# EasyEDA Pro project original-v2.epro, board PCB2
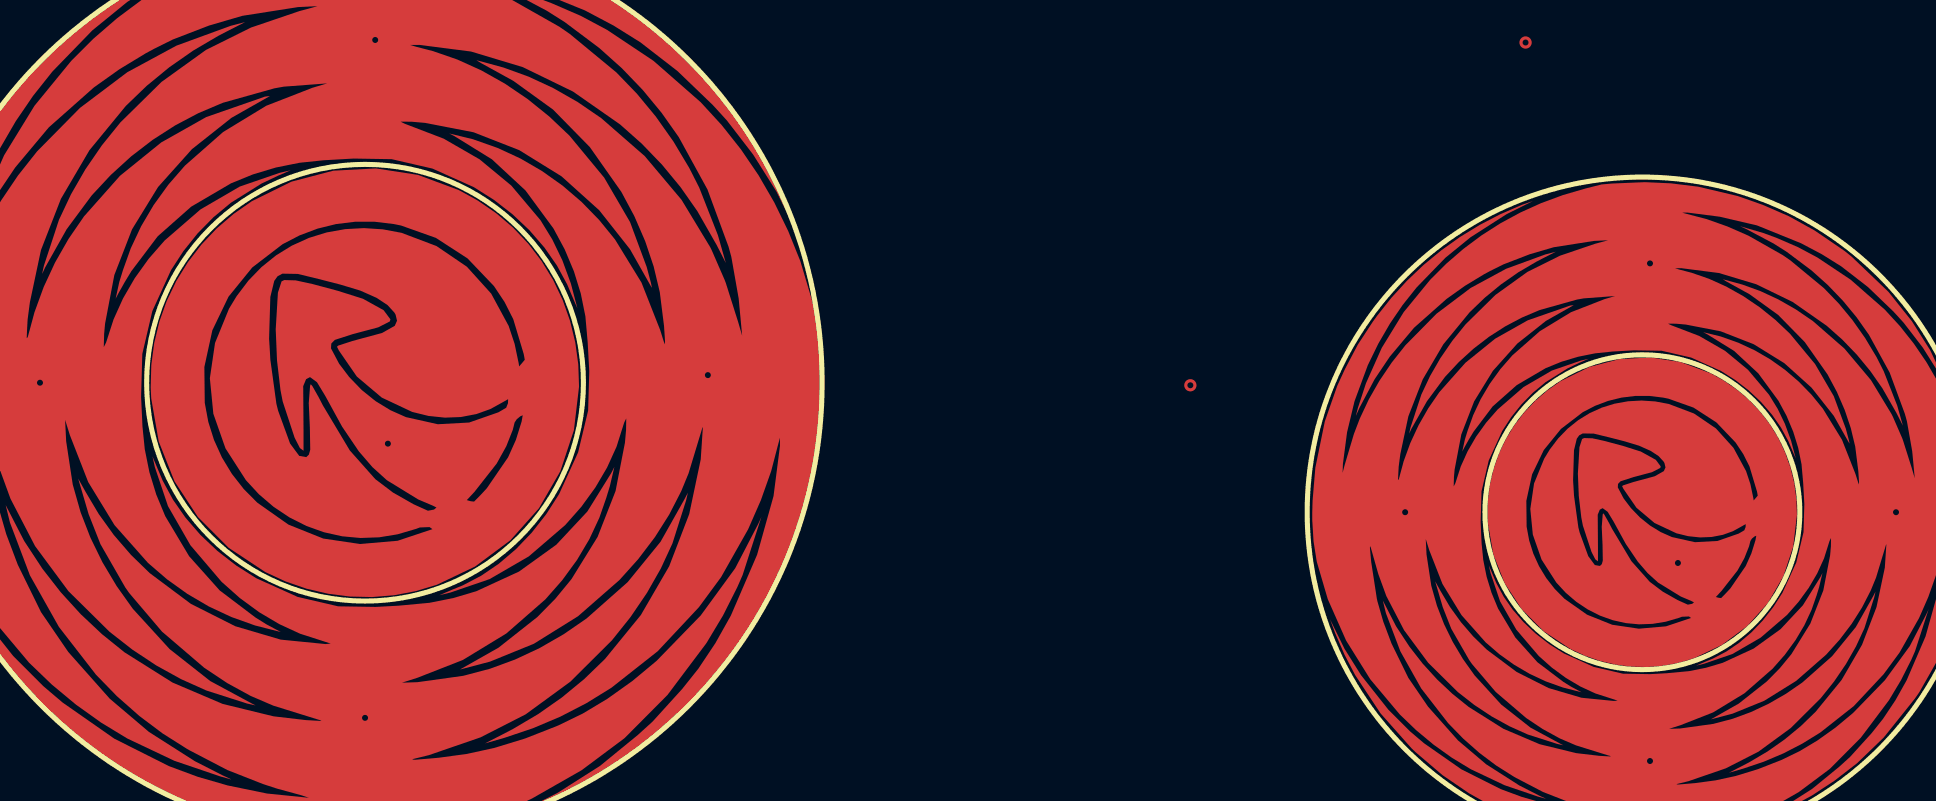
[diagram p11: board, top side]
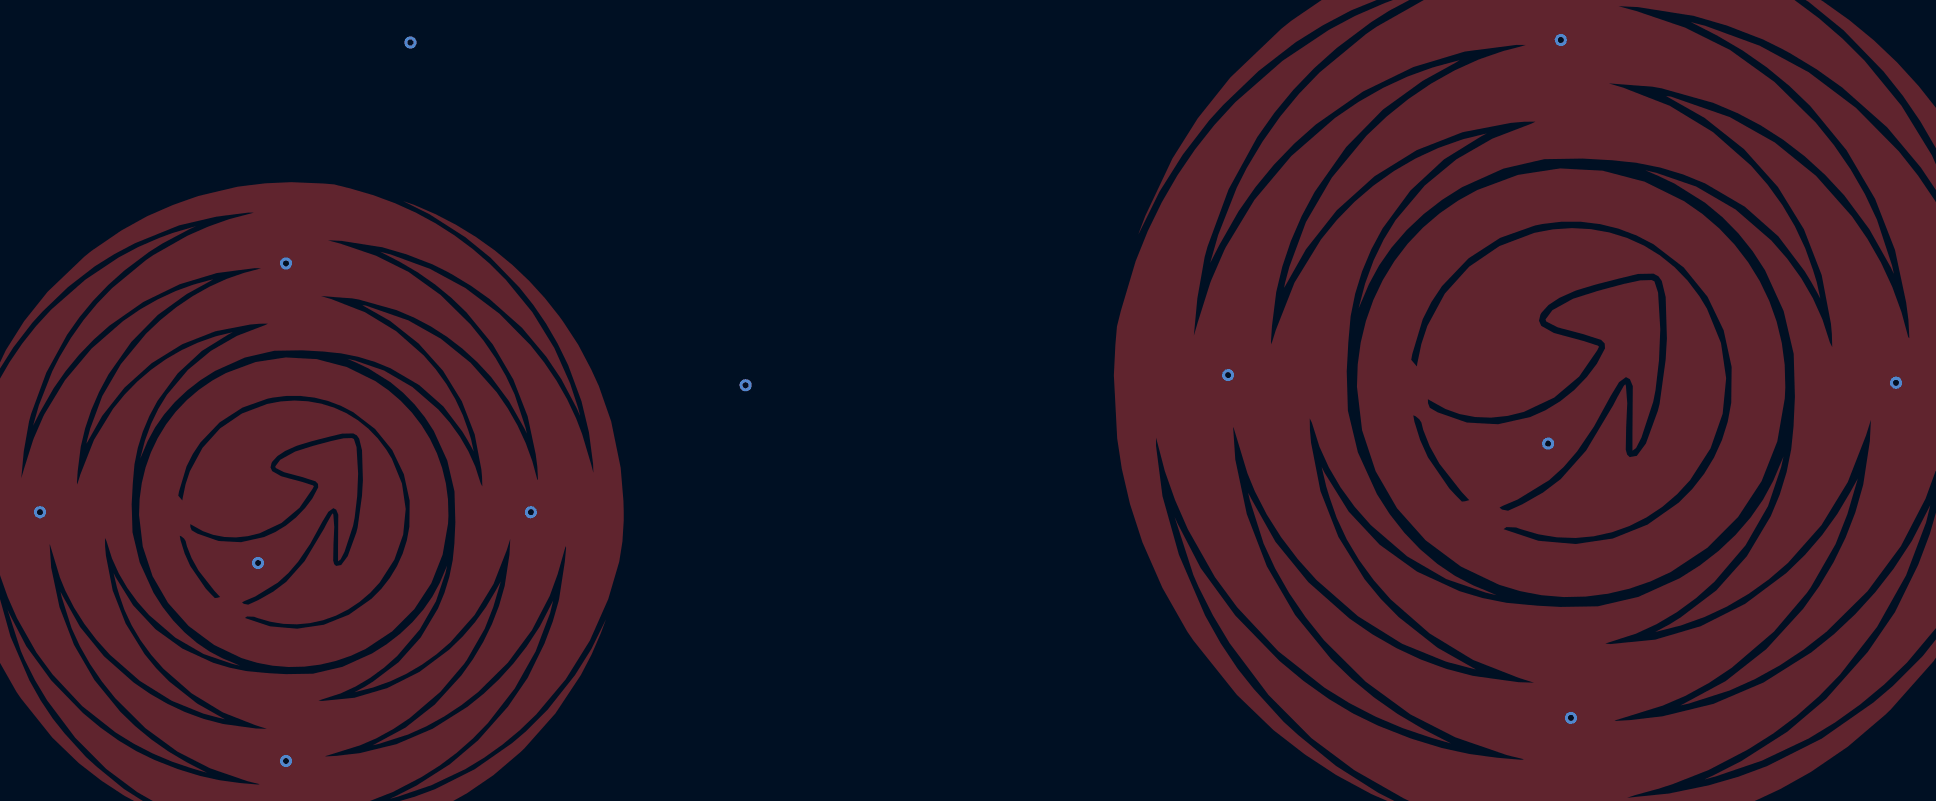
[diagram p12: board, bottom side, seen from below]

No outline. copper layers: Top Layer, Bottom Layer. Coordinates in mm from the lowest, leftmost part position.
Stack: Top Layer 0.035mm / Dielectric1 1.51mm FR4 er 4.5 / Bottom Layer 0.035mm

## Design rules (mm)
spacing copperThickness1oz (default): track to track 0.102, other pairs 0.152 to 0.3
spacing copperThickness2oz: track to track 0.203, other pairs 0.152 to 0.3
track width copperThickness1oz (default): min 0.127, default 0.254, max 2.54
track width copperThickness2oz: min 0.203, default 0.254, max 2.54
differential pair differentialPair (default): width min 0.127, default 0.254, max 2.54; gap min 0.152, default 0.152

## Placement (name value [footprint] x y rotation side)

## Nets

## Via types
v1: diameter 0.61, hole 0.305, Top Layer to Bottom Layer, 12 vias

## Routing (per net, layer and track width the routed paths; a pad name or vN(x,y) marks a point on that pad's centre or on a via; arc(x,y) is an arc through that point)
(no net):
  vias: v1(201.76,-116.6) v1(214.01,-104.16) v1(214.01,-129.05) v1(215.41,-119.14) v1(226.31,-116.6)
TOUCH_PAD1:
  vias: v1(150.25,-92.98) v1(207.78,-93.11)
TOUCH_PAD2:
  vias: v1(166.89,-109.75)
TOUCH_PAD3:
  vias: v1(133.49,-110.13) v1(191.02,-110.25)
TOUCH_PAD4:
  vias: v1(150.89,-113.17)
TOUCH_PAD5:
  vias: v1(149.75,-126.89)

Small or netless copper shapes (teardrops, artwork), in the pictures only: 10 on Top Layer
